# Altium schematic sheet WSPS-325-150K-PEFA驱动插件接线图2.SchDoc
size 594 x 419 mm; SheetNumber: 0; SheetTotal: 0; PageSetup: Record=PageOptions|CenterHorizontal=True|CenterVertical=True|PrintScale=0.49|XCorrection=1.00|YCorrection=1.00|PrintKind=0|BorderSize=5000000|LeftOffset=0|BottomOffset=0|Orientation=2|PaperLength=2970|PaperWidth=2100|Scale=100|PaperSource=7|PrintQuality=600|MediaType=1|DitherType=10|PaperKind=A4|PrintScaleMode=1
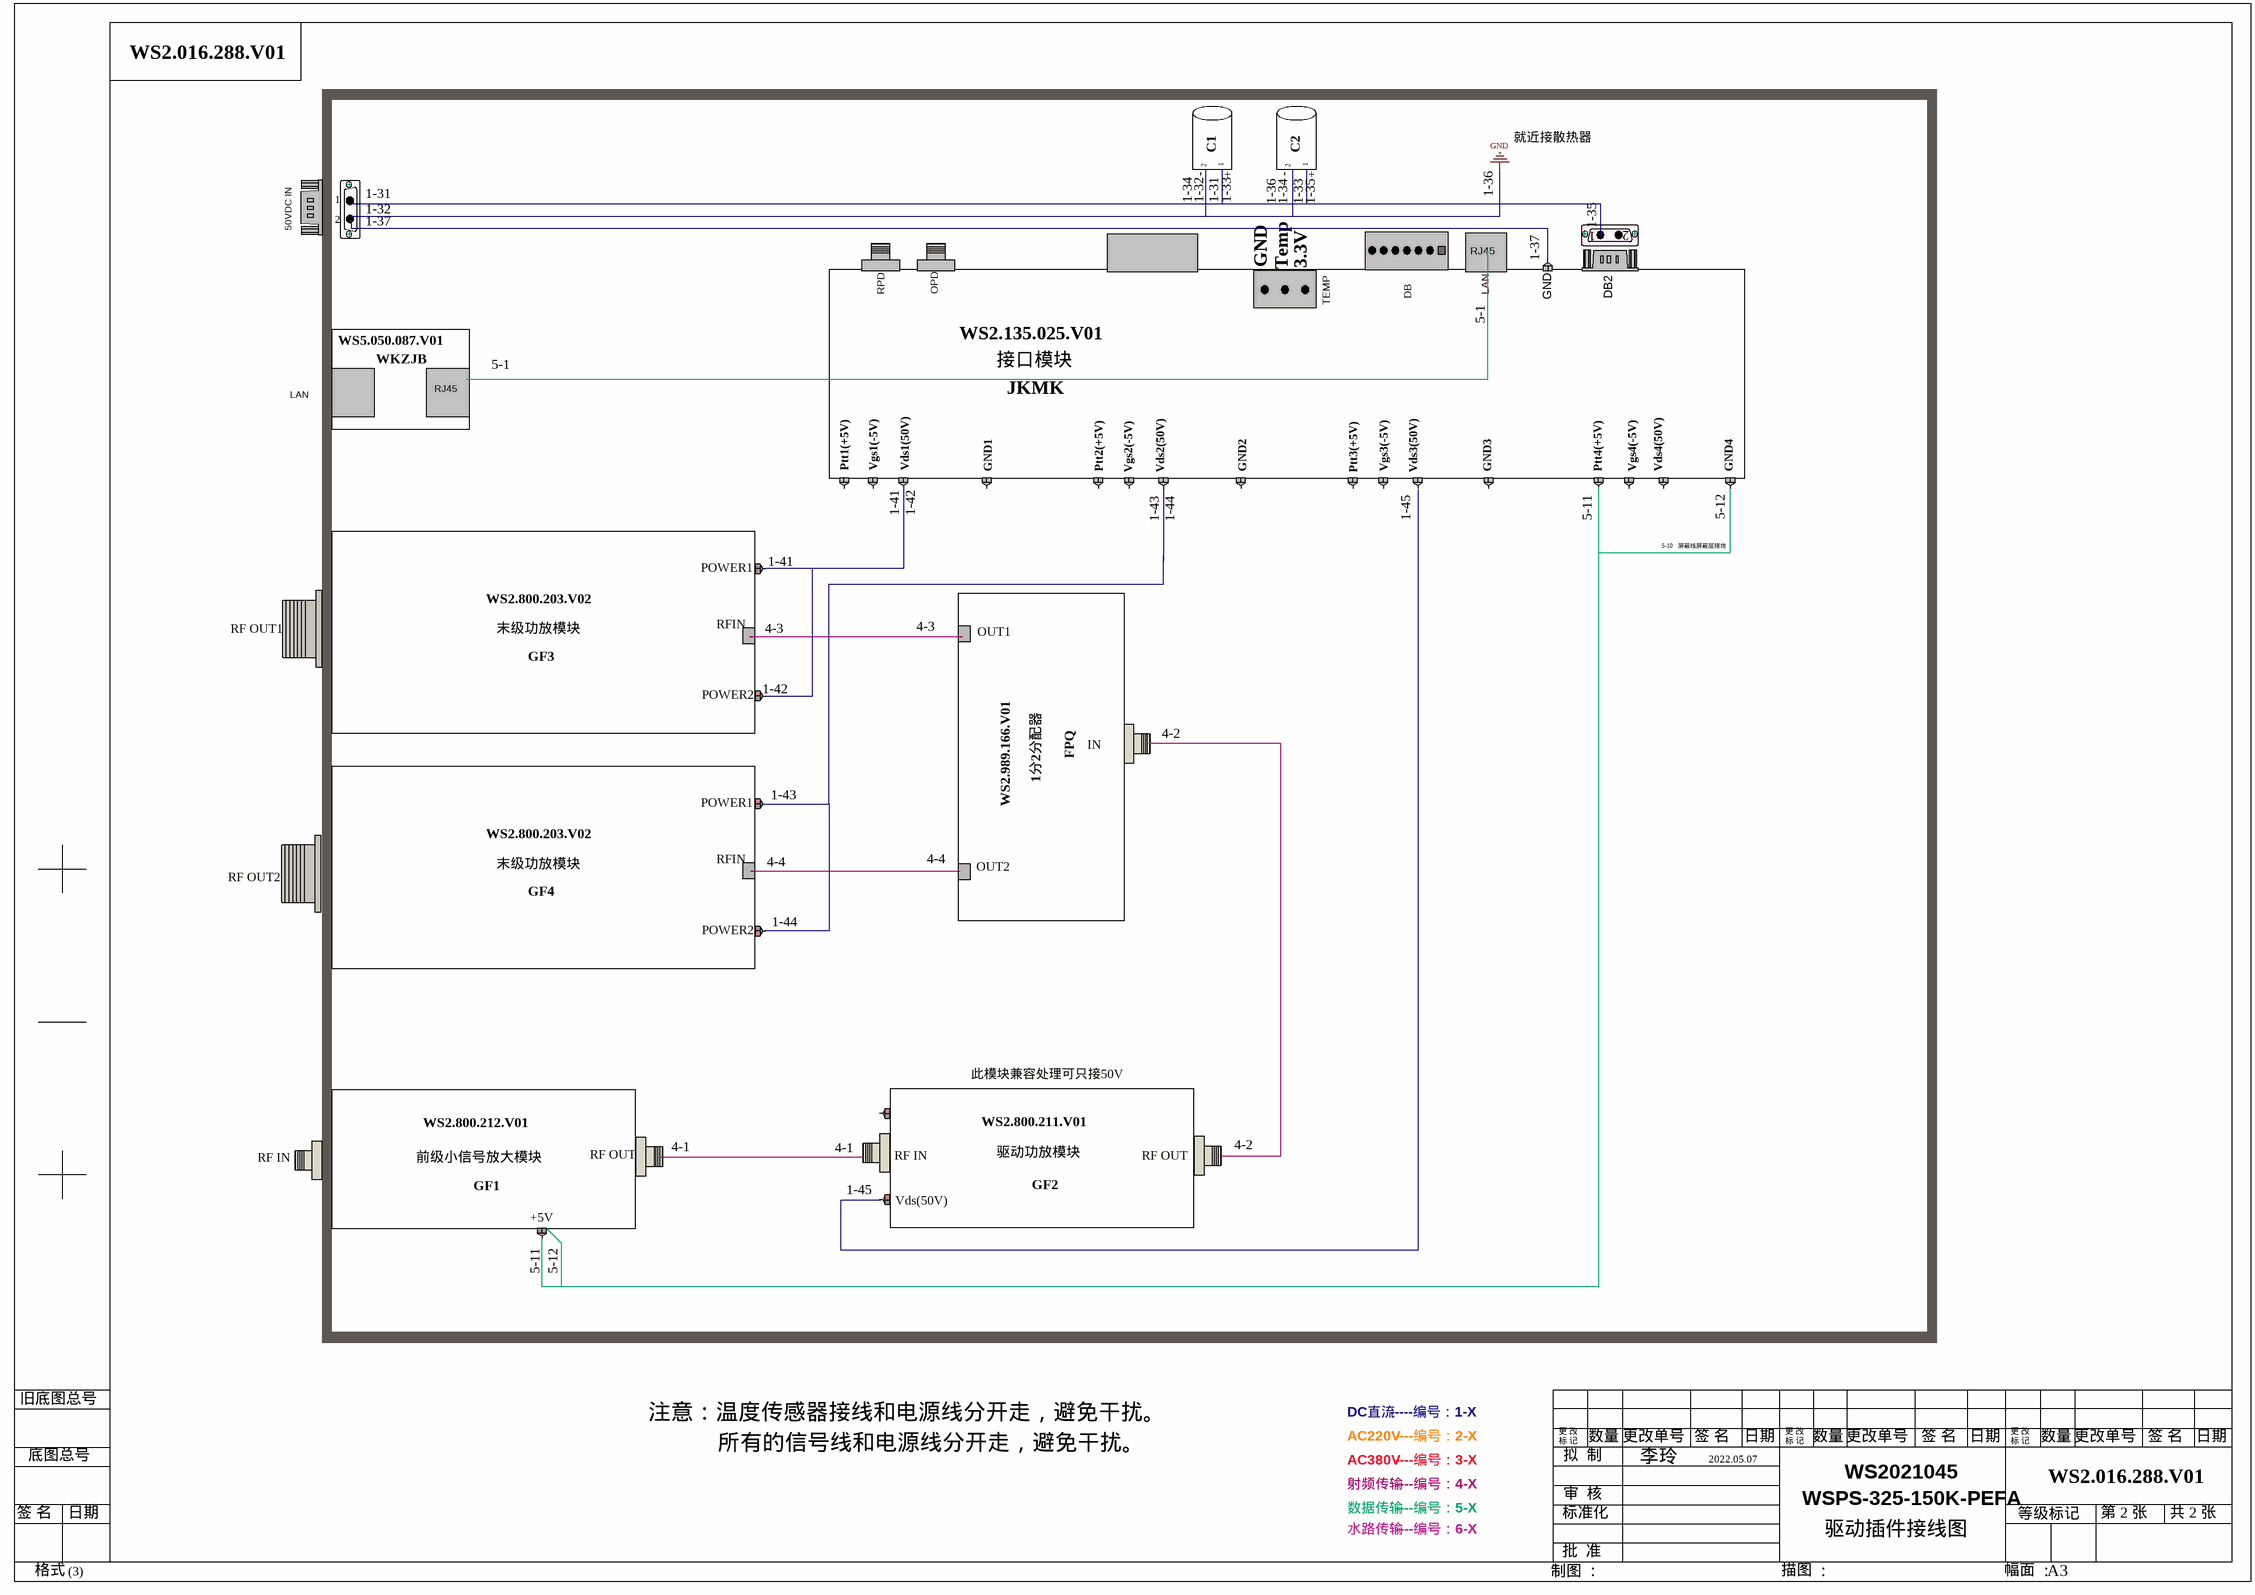
[diagram p0: WSPS-325-150K-PEFA驱动插件接线图2.SchDoc]

## Notes on the sheet
- 1
- 1-31
- 1-32
- 1-34
- 1-33
- 1-36
- 1-35
- 2
- 1-37
- 5-1
- 1-41
- 1-42
- 1-43
- 1-44
- 1-45
- 5-11
- 5-12
- 4-3
- 4-2
- 4-4
- 4-1
- 旧底图总号
- 更 改
- 标 记
- 数量
- 更改单号
- 签 名
- 日期
- 底图总号
- 拟  制
- 审  核
- 标准化
- 等级标记
- 第 2 张
- 共 2 张
- 格式
- (3)
- 制图
- 批  准
- ：
- 描图
- 幅面
- Labels drawn without touching a wire or pin: 1, 1分2分配器, 2, 3.3V, 5-10, 50VDC IN, 2022.05.07, +, +5V, -, -----编号：1-X, ----编号：2-X, ----编号：3-X, ----编号：4-X, ----编号：5-X, ----编号：6-X, A3, AC220V, AC380V, C1, C2, DB, DB2, DC直流, FPQ, GF1, GF2, GF3, GF4, GND, GND1, GND2, GND3, GND4, IN, JKMK, LAN, OPD, OUT1, OUT2, POWER1, POWER2, Ptt1(+5V), Ptt2(+5V), Ptt3(+5V), Ptt4(+5V), RF IN, RF OUT, RF OUT1, RF OUT2, RFIN, RJ45, RPD, TEMP, Temp, Vds1(50V), Vds2(50V), Vds3(50V), Vds4(50V), Vds(50V), Vgs1(-5V), Vgs2(-5V), Vgs3(-5V), Vgs4(-5V), WKZJB, WS2.016.288.V01, WS2.135.025.V01, WS2.800.203.V02, WS2.800.211.V01, WS2.800.212.V01, WS2.989.166.V01, WS5.050.087.V01, WS2021045, WSPS-325-150K-PEFA, 前级小信号放大模块, 射频传输, 就近接散热器, 屏蔽线屏蔽层接地, 所有的信号线和电源线分开走，避免干扰。, 接口模块, 数据传输, 末级功放模块, 李玲, 此模块兼容处理可只接50V, 水路传输, 注意：温度传感器接线和电源线分开走，避免干扰。, 驱动功放模块, 驱动插件接线图